# Altium schematic sheet connector_motor.SchDoc
size A
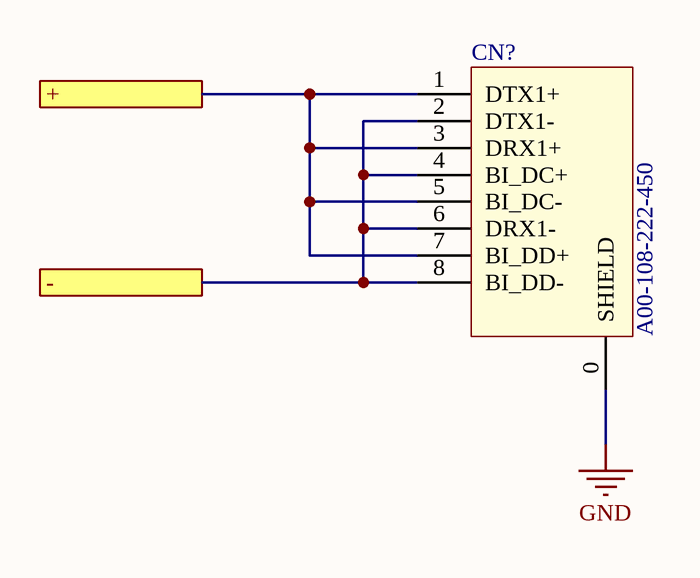
[diagram p0: connector_motor.SchDoc]

## Parts
CN?  MFG P/N: A00-108-222-450  [RJ45 TOP ENTRY EDAC A00-108-222-450]  (hidden comment: CONN_RJ45_TOP_A00-108-222-450)

## Ports
+, -

## Nets
GND: CN?.0(SHIELD)
+: CN?.1(DTX1+) CN?.3(DRX1+) CN?.5(BI_DC-) CN?.7(BI_DD+) ; port +
-: CN?.2(DTX1-) CN?.4(BI_DC+) CN?.6(DRX1-) CN?.8(BI_DD-) ; port -

## Library data of the parts
CN? = 492: CONN, RJ-45, 1-PORT, 8-POS, VERT, 0.76um GOLD, TH; ID: 492; MFG: EDAC Inc; COMMON: 210-00203-00; XPN: XS-10003929; Status: In Development; RoHS Compliant: Yes; LOON: 210-00203-00; Gecko: 210-00203-00